# EAGLE design current sensor (EAGLE 7.6.0)
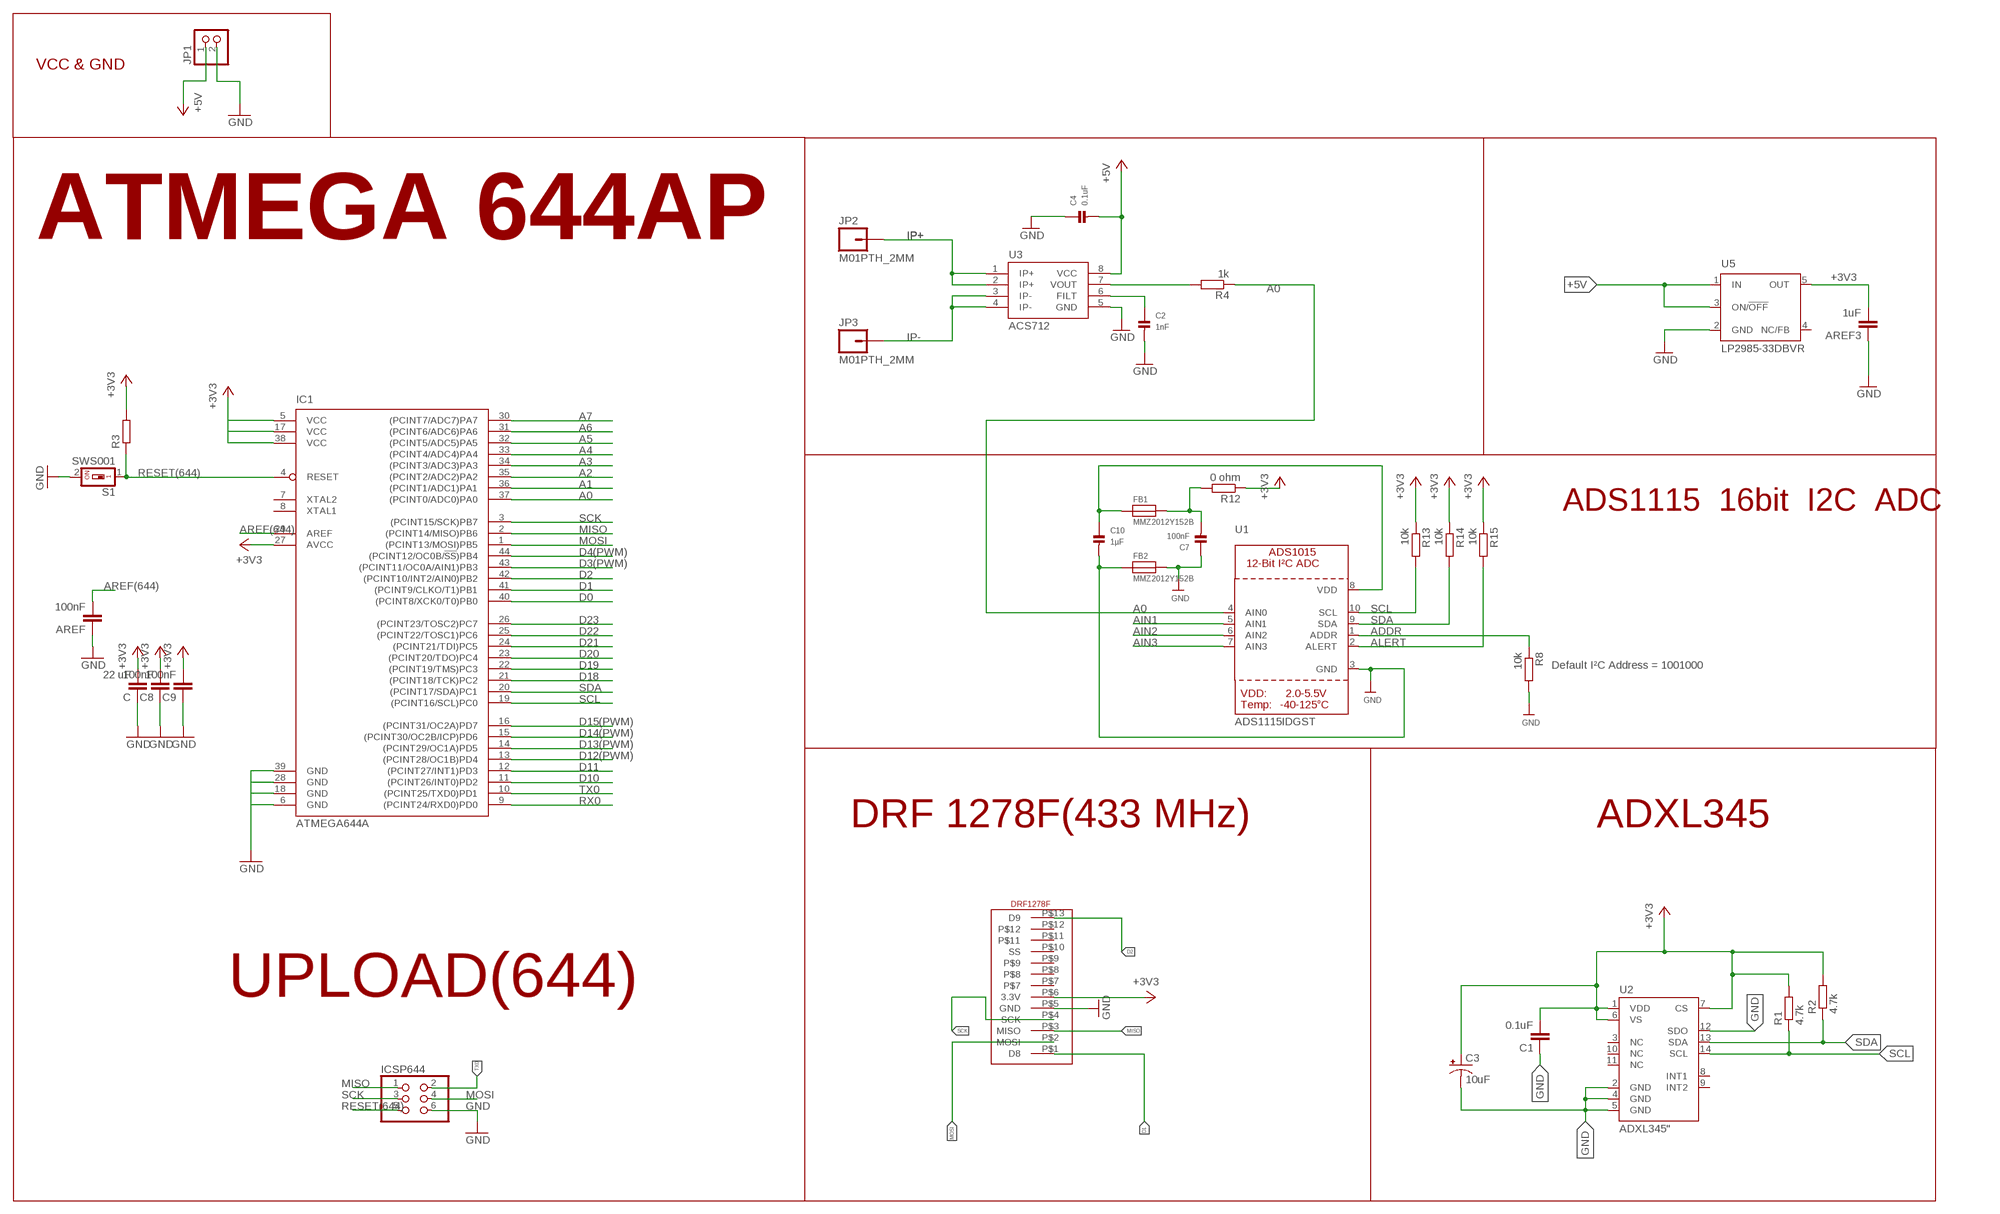
[diagram p0: schematic, sheet 1]

## Parts
AREF  100nF  C-EUC0805  [C0805]
AREF3  1uF  C-EUC0805  [C0805]
C  22 uF  C-EUC0805  [C0805]
C1  0.1uF  C-EUC0805  [C0805]
C2  1nF  CAP_CERAMIC0805  [0805]
C3  10uF  CAP_POL1206  [EIA3216]
C4  0.1uF  CAP_CERAMIC0805  [0805]
C7  100nF  CAP_CERAMIC0805  [0805]
C8  100nF  C-EUC0805  [C0805]
C9  100nF  C-EUC0805  [C0805]
C10  1µF  CAP_CERAMIC0805  [0805]
FB1  MMZ2012Y152B  FERRITE0805  [0805]
FB2  MMZ2012Y152B  FERRITE0805  [0805]
IC1  ATMEGA644A  [TQFP44]
ICSP644  PINHD-2X3  [2X03]
JP1  PINHD-1X2  [1X02]
JP2  M01PTH_2MM  [1X01_2MM]
JP3  M01PTH_2MM  [1X01_2MM]
R1  4.7k  R-EU_R0805  [R0805]
R2  4.7k  R-EU_R0805  [R0805]
R3  R-EU_R0805  [R0805]
R4  1k  R-EU_R0805  [R0805]
R8  10k  R-EU_R0805  [R0805]
R12  0 ohm  R-EU_R0805  [R0805]
R13  10k  R-EU_R0805  [R0805]
R14  10k  R-EU_R0805  [R0805]
R15  10k  R-EU_R0805  [R0805]
S1  SWS001  [SMS-001]
U1  ADS1115IDGST  ADC_ADS1015  [MSOP10]
U2  ADXL345"  [ADXL3451:1]
U3  ACS712  [SO08]
U5  LP2985-33DBVR  LP2985-XXDBVR33  [SOT23-DBV]
U$1  DRF1278F  [DIP13]

## Nets
+3V3: AREF3.2 C1.2 C3.A(+) C8.2 C9.2 C.2 IC1.5(VCC) IC1.17(VCC) IC1.27(AVCC) IC1.38(VCC) R1.2 R2.2 R3.2 R12.1 R13.1 R14.1 R15.1 U2.1(VDD) U2.6(VS) U2.7(CS) U5.5(OUT) U$1.P$6(3.3V)
+5V [usbvcc]: C4.2 JP1.1 U3.8(VCC) U5.1(IN) U5.3(ON/!OFF)
A0: IC1.37((PCINT0/ADC0)PA0) R4.1 U1.4(AIN0)
A1: IC1.36((PCINT1/ADC1)PA1)
A2: IC1.35((PCINT2/ADC2)PA2)
A3: IC1.34((PCINT3/ADC3)PA3)
A4: IC1.33((PCINT4/ADC4)PA4)
A5: IC1.32((PCINT5/ADC5)PA5)
A6: IC1.31((PCINT6/ADC6)PA6)
A7: IC1.30((PCINT7/ADC7)PA7)
ADDR: R8.1 U1.1(ADDR)
AIN1: U1.5(AIN1)
AIN2: U1.6(AIN2)
AIN3: U1.7(AIN3)
ALERT: R15.2 U1.2(ALERT)
AREF(644): AREF.2 IC1.29(AREF)
D0: IC1.40((PCINT8/XCK0/T0)PB0)
D1: IC1.41((PCINT9/CLKO/T1)PB1) U$1.P$1(D8)
D2: IC1.42((PCINT10/INT2/AIN0)PB2) U$1.P$13(D9)
D3(PWM): IC1.43((PCINT11/OC0A/AIN1)PB3)
D4(PWM): IC1.44((PCINT12/OC0B/!SS!)PB4)
D10: IC1.11((PCINT26/INT0)PD2)
D11: IC1.12((PCINT27/INT1)PD3)
D12(PWM): IC1.13((PCINT28/OC1B)PD4)
D13(PWM): IC1.14((PCINT29/OC1A)PD5)
D14(PWM): IC1.15((PCINT30/OC2B/ICP)PD6)
D15(PWM): IC1.16((PCINT31/OC2A)PD7)
D18: IC1.21((PCINT18/TCK)PC2)
D19: IC1.22((PCINT19/TMS)PC3)
D20: IC1.23((PCINT20/TDO)PC4)
D21: IC1.24((PCINT21/TDI)PC5)
D22: IC1.25((PCINT22/TOSC1)PC6)
D23: IC1.26((PCINT23/TOSC2)PC7)
GND: AREF3.1 AREF.1 C1.1 C2.2 C3.C(-) C4.1 C7.1 C8.1 C9.1 C10.2 C.1 FB2.1 FB2.2 IC1.6(GND) IC1.18(GND) IC1.28(GND) IC1.39(GND) ICSP644.6 JP1.2 R8.2 S1.2 U1.3(GND) U2.2(GND) U2.4(GND) U2.5(GND) U2.12(SDO) U3.5(GND) U5.2(GND) U$1.P$5(GND)
IP+: JP2.1 U3.1(IP+) U3.2(IP+)
IP-: JP3.1 U3.3(IP-) U3.4(IP-)
MISO: IC1.2((PCINT14/MISO)PB6) ICSP644.1 U$1.P$3(MISO)
MOSI: IC1.1((PCINT13/MOSI)PB5) ICSP644.4 U$1.P$2(MOSI)
N$3: R4.2 U3.7(VOUT)
N$7: C7.2 FB1.2 R12.2
N$8: C10.1 FB1.1 U1.8(VDD)
N$10: C2.1 U3.6(FILT)
RESET(644): IC1.4(RESET) ICSP644.5 R3.1 S1.1
RX0: IC1.9((PCINT24/RXD0)PD0)
SCK: IC1.3((PCINT15/SCK)PB7) ICSP644.3 U$1.P$4(SCK)
SCL: IC1.19((PCINT16/SCL)PC0) R1.1 R13.2 U1.10(SCL) U2.14(SCL)
SDA: IC1.20((PCINT17/SDA)PC1) R2.1 R14.2 U1.9(SDA) U2.13(SDA)
TX0: IC1.10((PCINT25/TXD0)PD1) ICSP644.2
Unconnected: IC1.7(XTAL2) IC1.8(XTAL1) U2.3(NC) U2.8(INT1) U2.9(INT2) U2.10(NC) U2.11(NC) U5.4(NC/FB) U$1.P$7 U$1.P$8 U$1.P$9 U$1.P$10(SS) U$1.P$11 U$1.P$12

## Notes on the sheet
- VCC & GND
- ATMEGA 644AP
- ADS1115  16bit  I2C  ADC
- Default I²C Address = 1001000
- DRF 1278F(433 MHz) | ADXL345
- UPLOAD(644)

## Library data of the parts
AREF AREF3 C C1 C8 C9 = rcl:C-EU: CAPACITOR, European symbol
C2 C4 C7 C10 = microbuilder:CAP_CERAMIC: Ceramic Capacitors 0402 - 0402 Surface Mount Capacitors 16pF 50V 5% [Digikey: 445-4899-2-ND] 18pF 50V 5% [Digikey: 490-1281-2-ND] 22pF 50V 5% [Digikey: 490-1283-2-ND] 68pF 50V 5% [Digikey: 490-1289-2-ND] 0.1uF 10V 10% [Digikey: 490-1318-2-ND] 1.0uF 6.3V 10% [Digikey: 490-1320-2-ND] 0603 - 0603 Surface Mount Capacitors 16 pF 50V 5% [Digikey: 445-5051-2-ND] 22 pF 50V [Digikey: PCC220ACVTR-ND] 33 pF 50V 5% [Digikey: 490-1415-1-ND] 56pF 50V 5% [Digikey: 490-1421-1-ND] 220pF 50V 5% [Digikey: 445-1285-1-ND] 680 pF 50V 2200 pF 50V 5% C0G [Digikey: 445-1297-1-ND] 5600 pF 100V 5% X7R [Digikey: 478-3711-1-ND] 0.1 µF 25V 10% [Digikey: PCC2277TR-ND] 0.22 µF 16V 10% X7R [Digikey: 445-1318-1-ND] 1.0 µF 25V 10% [Digikey: 445-5146-2-ND] 0603 - RF Specific 3pF 250V +/-0.1pF RF [Digikey: 712-1347-1-ND] 18 pF 250V 5% [Digikey: 478-3505-1-ND or 712-1322-1-ND] 56 pF 250V 5% C0G RF [Digikey: 490-4867-1-ND] 68 pF 250V RF [Digikey: 490-4868-1-ND] 0805 - 0805 Surface Mount Capacitors 220 pF 250V 2% RF Ceramic Capacitor [Digikey: 712-1398-1-ND] 1000 pF 50V 2% NP0 Ceramic Capacitor [Digikey: 478-3760-1-ND] 0.1 µF 25V 10% Ceramic Capacitor [Digikey: PCC1828TR-ND] 1.0 µF 16V 10% Ceramic Capacitor[Digikey: 490-1691-2-ND] 10.0 µF 10V 10% Ceramic Capacitor[Digikey: 709-1228-1-ND] 10.0 uF 16V 10% Ceramic Capacitor [Digikey: 478-5165-2-ND] 47 uF 6.3V 20% Ceramic Capacitor [Digikey: 587-1779-1-ND or 399-5506-1-ND] 1206 - 1206 Surface Mount Capacitors 47uF 10V 20% Ceramic Capacitor [Digikey: 490-5528-1-ND or 399-5508-1-ND or 445-6010-1-ND] 100uF 6.3V -20%, +80% Y5V Ceramic Capacitor (Digikey: 490-4512-1-ND, Mouser: 81-GRM31CF50J107ZE1L)
C3 = SparkFun:CAP_POL: Capacitor Polarized These are standard SMD and PTH capacitors. Normally 10uF, 47uF, and 100uF in electrolytic and tantalum varieties. Always verify the external diameter of the through hole cap, it varies with capacity, voltage, and manufacturer. The EIA devices should be standard.
FB1 FB2 = microbuilder:FERRITE: Ferrite Bead 0603 MMZ1608B121C - 120 Ohm, 600mA Ferrite Chip - Digikey: 445-2164-1-ND BK1608HW121-T - 120 Ohm, 600mA Ferrite Chip - Digikey: 587-1876-2-ND 0805 HZ0805B272R-10 - 2.7K Ohm @ 100MHz, 200mA 0.8 Ohm DC Resistance - Digikey: 240-2504-1-ND (see also Murata BLM21BD272SN1L)
IC1 = atmel:ATMEGA644: 8-bit Microcontroller with 64K Bytes In-System Programmable Flash Source: http://www.atmel.com/dyn/resources/prod_documents/doc2593.pdf; MPN: ATMEGA644PV-10AU; OC_FARNELL: 1455123; OC_NEWARK: 58M3748
ICSP644 = pinhead:PINHD-2X3: PIN HEADER
JP1 = pinhead:PINHD-1X2: PIN HEADER
JP2 JP3 = SparkFun:M01: Header 1 Standard 1-pin 0.1" header. Use with straight break away headers (SKU : PRT-00116), right angle break away headers (PRT-00553), swiss pins (PRT-00743), machine pins (PRT-00117), and female headers (PRT-00115).
R1-R4 R8 R12-R15 = resistor:R-EU_: RESISTOR, European symbol
S1 = smd-special:SWS001: SMD Dip Switch 1 pol.
U1 = microbuilder:ADC_ADS1015: ADS1015 - 12-bit 4-Channel I2C ADC with Internal PGA VDD: 2.0-5.5V Sampling Rate: 3.3ksps Gain Settings: 2/3, 1, 2, 4, 8, 16 I2C Address: ADDR low = 1001000x, ADDR high = 1001001x Internal Comparator The ADS1015 includes an internal comparator that can be set to output a high-level on ALERT when the conversion results exceeeds a pre-defined upper level, and will deassert itself when the level falls below a pre-defined lower threshold level. It can also be set to windowed mode where the ALERT pin will be asserted if the data exceeds the upper threshold or falls below the lower threshold.
U2 = SparkFun-Sensors:ADXL345: 3-axis SPI/I2C 2/4/8/16g accelerometer; PROD_ID: IC-09097
U3 = SparkFun:ACS712
U5 = SmartPrj:LP2985-XXDBVR: ULTRALOW-POWER 50-mA LOW-DROPOUT LINEAR REGULATORS 50-mA Low-Dropout Regulator Source: http://focus.ti.com/lit/ds/symlink/tps77001.pdf
U$1 = small_header:DRF1278F

## Net classes
0 default: width 0.254 mm, clearance 0.254 mm
3 usbvcc: width 0.508 mm, drill 0.61 mm, clearance 0.254 mm

## Board
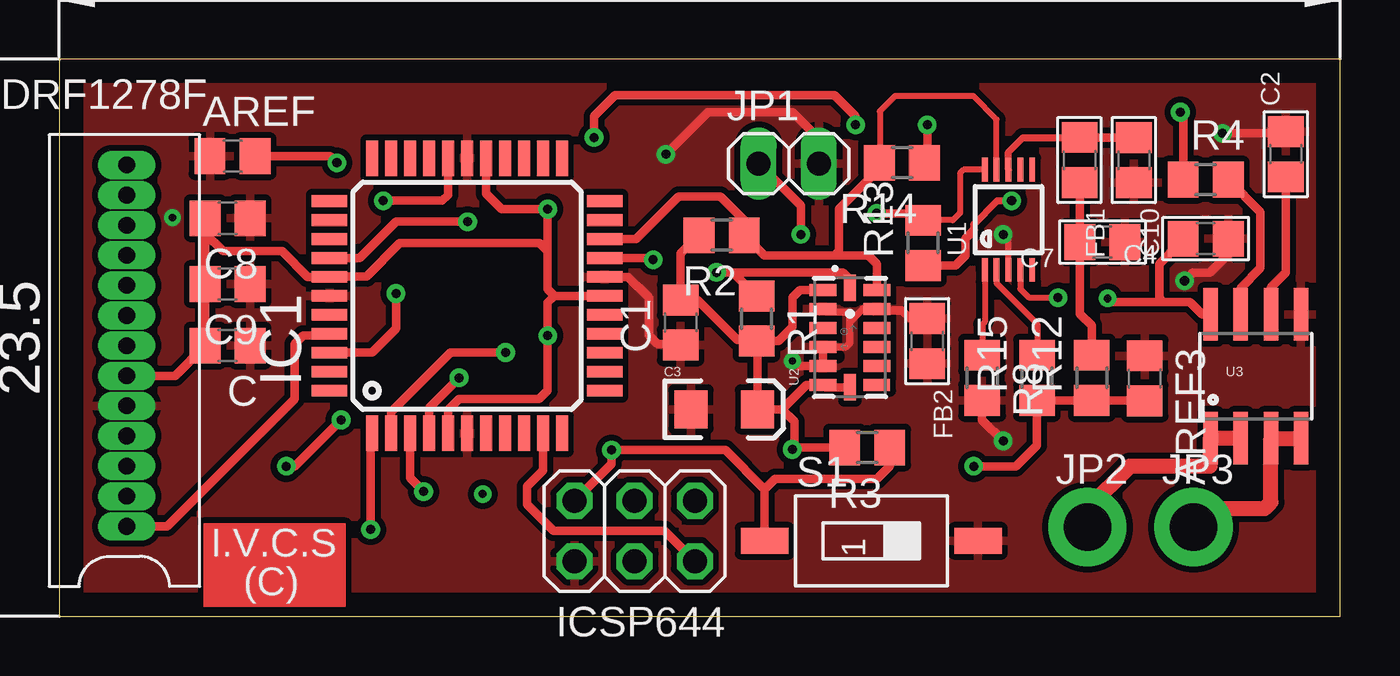
[diagram p1: board, top side]
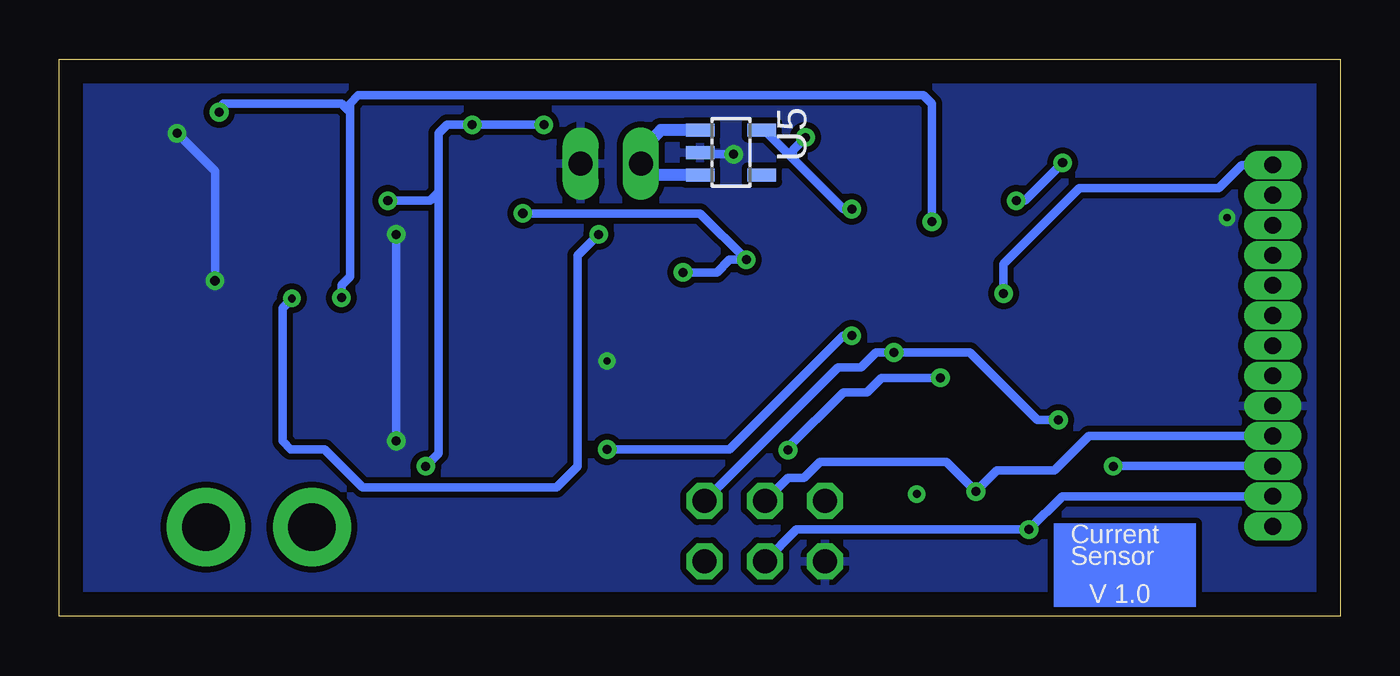
[diagram p2: board, bottom side, seen from below]

Size 54 x 23.5 mm. Coordinates in mm from the lower left corner, seen from the top.
Outline: 0,0 54,0 54,23.5 0,23.5 0,0
Copper layers (1*16): Top 0.035mm / dielectric 1.5mm / Bottom 0.035mm
Design rules "default *": minimum track width 10mil, minimum drill 11mil, track to track 6mil, track to pad 6mil, pad to pad 6mil, via to via 6mil, smd to smd 6mil, copper to edge 40mil, drill to drill 8mil, minimum pad ring 10mil, minimum via ring 8mil, stop-mask expansion 4mil, vias tented up to drill 0mil, thermal gap 10mil

### Footprints (pad centres in the part's own frame; a part is rotated, then mirrored left to right if it is on the bottom)
C0805 = smd 1.3 x 1.5: 1 -0.95,0; 2 0.95,0
0805 = smd 1.3 x 1.5: 1 -0.95,0; 2 0.95,0
EIA3216 = smd 1.4 x 1.6: A 1.4,0; C -1.4,0
TQFP44 = smd 1.5 x 0.5: 1 -5.8,4; 2 -5.8,3.2; 3 -5.8,2.4; 4 -5.8,1.6; 5 -5.8,0.8; 6 -5.8,0; 7 -5.8,-0.8; 8 -5.8,-1.6; 9 -5.8,-2.4; 10 -5.8,-3.2; 11 -5.8,-4; 23 5.8,-4; 24 5.8,-3.2; 25 5.8,-2.4; 26 5.8,-1.6; 27 5.8,-0.8; 28 5.8,0; 29 5.8,0.8; 30 5.8,1.6; 31 5.8,2.4; 32 5.8,3.2; 33 5.8,4 | smd 0.5 x 1.5: 12 -4,-5.8; 13 -3.2,-5.8; 14 -2.4,-5.8; 15 -1.6,-5.8; 16 -0.8,-5.8; 17 0,-5.8; 18 0.8,-5.8; 19 1.6,-5.8; 20 2.4,-5.8; 21 3.2,-5.8; 22 4,-5.8; 34 4,5.8; 35 3.2,5.8; 36 2.4,5.8; 37 1.6,5.8; 38 0.8,5.8; 39 0,5.8; 40 -0.8,5.8; 41 -1.6,5.8; 42 -2.4,5.8; 43 -3.2,5.8; 44 -4,5.8
2X03 = drill 1.016 octagon: 1 -2.54,-1.27; 2 -2.54,1.27; 3 0,-1.27; 4 0,1.27; 5 2.54,-1.27; 6 2.54,1.27
1X02 = drill 1.016 long: 1 -1.27,0; 2 1.27,0
1X01_2MM = drill 2 pad 3.302: 1 0,0
R0805 = smd 1.3 x 1.5: 1 -0.95,0; 2 0.95,0
SMS-001 = smd 1.092 x 2.007: 1 0,-4.496; 2 0,4.496
MSOP10 = smd 0.25 x 1: 1 -1,-2.113; 2 -0.5,-2.113; 3 0,-2.113; 4 0.5,-2.113; 5 1,-2.113; 6 1,2.113; 7 0.5,2.113; 8 0,2.113; 9 -0.5,2.113; 10 -1,2.113
ADXL3451:1 = smd 0.5 x 1.124: 1 2,1.138; 2 1.2,1.138; 3 0.4,1.138; 4 -0.4,1.138; 5 -1.2,1.138; 6 -2,1.138; 8 -2,-1.13; 9 -1.2,-1.138; 10 -0.4,-1.138; 11 0.4,-1.138; 12 1.2,-1.138; 13 2,-1.138 | smd 1.124 x 0.5: 7 -2.1,0; 14 2.1,0
SO08 = smd 0.61 x 2.21: 1 -1.905,-2.616; 2 -0.635,-2.616; 3 0.635,-2.616; 4 1.905,-2.616; 5 1.905,2.616; 6 0.635,2.616; 7 -0.635,2.616; 8 -1.905,2.616
SOT23-DBV = smd 0.55 x 1.2: 1 -0.95,-1.3; 2 0,-1.3; 3 0.95,-1.3; 4 0.95,1.3; 5 -0.95,1.3
DIP13 = drill 0.7 long: P$1 -2,0; P$2 -2,-1.27; P$3 -2,-2.54; P$4 -2,-3.81; P$5 -2,-5.08; P$6 -2,-6.35; P$7 -2,-7.62; P$8 -2,-8.89; P$9 -2,-10.16; P$10 -2,-11.43; P$11 -2,-12.7; P$12 -2,-13.97; P$13 -2,-15.24

### Placement (x,y rotation side)
AREF  7.3,19.42 0 top
AREF3  45.76,10.05 270 top
C  7.1,11.43 180 top
C1  26.19,12.4 90 top
C2  51.71,19.49 90 top
C3  28.03,8.74 0 top
C4  48.33,15.94 180 top
C7  43.98,15.79 180 top
C8  7.1,16.8 180 top
C9  7.1,14.02 180 top
C10  45.3,19.25 270 top
FB1  43.01,19.25 270 top
FB2  36.59,11.61 270 top
IC1  17.19,13.52 90 top
ICSP644  24.26,3.6 180 top
JP1  30.75,19.1 0 top
JP2  43.34,3.76 0 top
JP3  47.82,3.76 0 top
R1  29.4,12.57 270 top
R2  27.92,16.08 180 top
R3  34.06,7.13 180 top
R4  48.33,18.42 0 top
R8  38.9,10.07 270 top
R12  43.53,10.07 90 top
R13  36.42,15.76 90 top
R14  35.53,19.14 180 top
R15  41.22,10.07 90 top
S1  34.23,3.19 270 top
U1  40.01,16.73 0 top
U2  33.33,11.77 90 top
U3  50.44,10.13 0 top
U5  25.68,19.56 270 bottom
U$1  0.84,3.8 180 top

### Tracks (layer width: path | path; a pad name or v marks a point on that pad's centre or on a via)
+3V3  (via drill 0.38)
  Top 0.305: R1.2 29.61,11.62 | 38.55,16.29 38.55,16.54 39.55,17.54 v40.15,17.54
  Top 0.356: IC1.27 17.99,17.83 18.64,17.18 v20.59,17.18 20.59,15.4 | 20.59,15.4 20.59,14.34 | 20.59,14.34 20.59,13.8 20.87,13.52 | 20.87,13.52 IC1.17 | 20.58,14.32 20.59,14.34 | U$1.P$6 4.88,10.15 C.2 C9.2 C8.2 6.15,16.16 6.9,15.4 9.39,15.4 10.47,14.32 IC1.38 11.4,14.34 12.95,14.34 14.36,15.75 20.25,15.75 20.59,15.4 | v30.9,7.04 30.98,7.13 | 30.98,7.13 R3.2 | IC1.5 16.39,8.71 16.86,9.18 20.24,9.18 20.59,9.53 v20.59,11.85 20.59,13.25 20.87,13.52 | R15.1 R12.1 45.74,9.12 AREF3.2 | R15.1 40.92,8.82 | v36.59,20.74 36.59,19.25 R14.1 | R13.1 37.78,14.81 38.19,15.22 38.19,15.94 38.55,16.29 | v22.55,20.2 22.55,21.09 23.44,21.98 32.68,21.98 33.57,21.09 v33.57,20.74 | v38.55,6.33 40.33,6.33 41.22,7.22 R15.1 | R2.2 26.19,15.3 C1.2 26.91,13.35 28.59,11.67 29.34,11.67 R1.2 29.43,11.58 C3.A 30.47,8.74 | 29.61,11.62 30.32,11.62 30.9,12.2 30.9,13.45 31.23,13.77 U2.1 | 30.47,8.74 31.49,9.77 U2.6 32.29,9.67 U2.7 | 30.98,7.13 30.98,8.22 30.47,8.74
  Bottom 0.356: v20.59,11.85 20.95,11.85 25.75,7.04 v30.9,7.04 | v20.59,17.18 20.95,17.18 23.08,19.31 | 23.08,19.31 24.28,20.51 U5.5 | 38.02,17.89 38.02,20.38 37.66,20.74 v36.59,20.74 v33.57,20.74 | 38.02,17.89 38.02,6.87 v38.55,6.33 | v40.15,17.54 38.37,17.54 38.02,17.89 | v22.55,20.2 23.08,19.67 23.08,19.31
+5V  (via drill 0.33, 0.38)
  Top 0.356: JP1.1 31.26,17.32 v31.26,16.11 | 46.55,13.27 47.66,13.27 48.18,12.74 U3.8 | C4.2 47.62,15.7 47.2,15.7 46.37,14.87 46.37,13.45 46.55,13.27 | v44.2,13.41 44.34,13.27 46.55,13.27
  Bottom 0.356: v44.2,13.41 44.59,13.01 44.59,7.4 44.24,7.04 42.82,7.04 41.22,5.45 33.04,5.45 32.15,6.33 32.15,15.22 v31.26,16.11
  Bottom 0.508: U5.3 29,18.61 JP1.1 29.48,19.67 28.64,20.51 U5.1
A0  (via drill 0.38)
  Top 0.254: U1.4 40.51,13.82 40.87,13.46 42.09,13.46 v42.1,13.45
  Top 0.356: IC1.37 12.67,15.12 14.19,16.65 v17.21,16.65 | v47.26,21.27 47.38,21.15 R4.1
  Bottom 0.356: v17.21,16.65 17.21,21.62 17.57,21.98 41.39,21.98 41.75,21.62 41.75,21.27 | v42.1,13.45 42.1,13.98 41.75,14.34 41.75,21.27 | 41.75,21.27 42.1,21.62 47.08,21.62 47.26,21.45 v47.26,21.27
ADDR
  Top 0.254: U1.1 39.01,12.42 38.91,12.32 38.91,11.03 R8.1
ALERT
  Top 0.254: U1.2 39.51,14.05 41.22,12.34 R15.2
AREF(644)  (via drill 0.38)
  Top 0.356: AREF.2 11.42,19.42 v11.7,19.14 | v13.66,17.54 16.15,17.54 16.39,17.78 IC1.29
  Bottom 0.356: v11.7,19.14 13.3,17.54 v13.66,17.54
D1
  Top 0.356: U$1.P$1 4.55,3.8 9.92,9.18 9.92,11.49 10.28,11.85 11.31,11.85 IC1.41
D2  (via drill 0.38)
  Top 0.356: IC1.42 11.4,11.13 13.19,11.13 14.2,12.14 v14.2,13.62 v14.19,13.62
  Bottom 0.356: U$1.P$13 4.15,19.04 5.12,18.07 10.99,18.07 14.19,14.87 v14.19,13.62
GND  (via drill 0.3, 0.38)
  Top 0.254: U1.3 40.01,15.89 v39.79,16.11
  Top 0.305: U2.4 33.16,11.37 33.33,11.53 33.33,12.42 | 33.33,12.42 33.33,12.7 33.2,12.83 32.34,12.83 U2.2 | U2.12 33.87,12.97 33.33,12.42
  Top 0.356: IC1.18 23.98,14.32 24.86,13.45 24.86,11.85 25.21,11.49 26.15,11.49 C1.1 | FB2.1 35.88,12.56 35.53,12.91 34.53,12.91 U2.12 | JP1.2 32.02,20.15 30.9,21.27 27.35,21.27 v25.57,19.49 | v39.79,7.4 38.91,8.29 R8.2 | C4.1 49.28,15.29 48.51,14.51 47.8,14.51 v47.44,14.16 | v49.04,20.38 51.65,20.38 C2.2 | v30.9,10.78 31.11,10.57 U2.5 U2.4
  Bottom 0.356: v25.57,19.49 26.91,19.49 U5.2 | v39.79,16.11 v39.79,7.4 | v47.44,14.16 47.44,18.78 v49.04,20.38
  other vias: 4.77,16.82
  pour Top (isolate 0.254): 0.28,23.31 0.41,0.03 54.07,0.03 53.94,23.31
  pour Bottom (isolate 0.254): 0.18,23.31 53.94,23.31 53.97,-0.03 0.2,-0.03
IP+
  Top 0.635: JP2.1 43.34,4.55 45.13,6.33 48.51,6.33 48.51,7.48 U3.1 U3.2
IP-
  Top 0.635: JP3.1 48.61,4.56 50.82,4.56 51.08,4.82 U3.3 U3.4
MISO  (via drill 0.38)
  Top 0.356: v9.57,6.33 9.92,6.33 v11.88,8.29 | IC1.2 13.99,8.62 16.5,11.13 v18.81,11.13
  Bottom 0.356: U$1.P$3 9.56,6.34 v9.57,6.33 | ICSP644.1 21.17,10.5 20.21,10.5 19.57,11.13 v18.81,11.13 15.61,11.13 12.77,8.29 v11.88,8.29
MOSI  (via drill 0.38)
  Top 0.356: v13.12,3.67 13.12,7.66 IC1.1
  Bottom 0.356: ICSP644.4 22.92,3.67 v13.12,3.67 11.72,5.07 U$1.P$2
N$3
  Top 0.356: R4.2 50.64,17.06 50.64,14.69 49.81,13.86 U3.7
N$5  (via drill 0.33)
  other vias: 17.85,5.17
N$7
  Top 0.356: FB1.2 43.03,17.39 C7.2 43.03,12.76 43.53,12.26 R12.2
N$8
  Top 0.305: U1.8 40.01,19.59 40.62,20.19 43,20.19 FB1.1
  Top 0.356: C10.1 FB1.1
N$10
  Top 0.356: C2.1 51.71,14.51 51.08,13.88 U3.6
RESET(644)  (via drill 0.38)
  Top 0.356: S1.1 29.74,5.37 | 29.74,5.37 28.08,7.02 v23.28,7.02 23.28,6.44 ICSP644.5 | 15.61,7.75 IC1.4 15.59,8.8 v16.86,10.07 | R3.1 35.01,6.35 34.46,5.8 30.17,5.8 29.74,5.37
  Bottom 0.356: v16.86,10.07 19.35,10.07 19.96,9.46 20.95,9.46 23.28,7.12 v23.28,7.02
SCK  (via drill 0.38)
  Top 0.356: IC1.3 14.79,5.84 v15.36,5.27
  Bottom 0.356: U$1.P$4 10.6,7.61 12.06,6.16 14.47,6.16 v15.36,5.27 16.6,6.51 21.94,6.51 22.6,5.85 23.28,5.85 ICSP644.3
SCL  (via drill 0.38)
  Top 0.254: U1.10 38.12,18.85 37.97,18.69 37.97,17.02 37.67,16.71 R13.2
  Top 0.356: R1.1 28.4,14.51 | 28.4,14.51 v27.7,14.51 | IC1.19 24.96,15.12 v25.04,15.05 | 28.4,14.51 33.04,14.51 33.33,14.22 U2.14 | R13.2 36.12,17 v34.46,17
  Bottom 0.356: v27.7,14.51 26.28,14.51 25.75,15.05 v25.04,15.05 26.99,17 v34.46,17
SDA
  Top 0.254: U1.9 39.51,20.96 38.53,21.95 35.23,21.95 34.59,21.31 34.59,19.15 R14.2
  Top 0.356: 34.81,13.78 U2.13 34.47,14.86 34.1,15.22 32.68,15.22 | IC1.20 24.31,15.92 26.1,17.71 27.88,17.71 28.87,16.72 R2.1 29.73,15.22 32.68,15.22 | R14.2 34.58,18.9 32.86,17.18 32.86,15.4 32.68,15.22
TX0
  Top 0.356: ICSP644.2 25.51,3.62 20.84,3.62 19.73,4.73 19.73,5.5 20.39,6.16 IC1.10
(copper drawn outside any net)
  shapes: Bottom area x1, Top area x1

### Text on the board
tPlace: I.V.C.S | (C)
bPlace: Current | Sensor | V 1.0